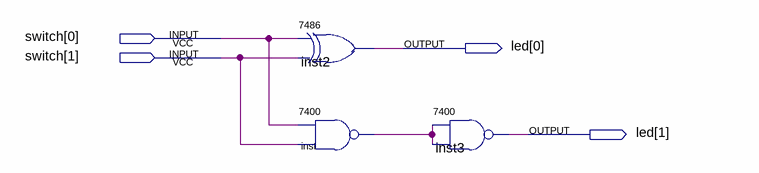
[diagram p0: schematic sheet]
// Quartus schematic pj201.bdf as structural Verilog: 3 symbols, 4 pins
module pj201 (
  input  [1:0] switch,
  output [1:0] led
);

  wire inst_1;

  \7486  inst2 (.\2 (switch[0]), .\3 (switch[1]), .\1 (led[0]));
  \7400  inst (.\3 (switch[1]), .\2 (switch[0]), .\1 (inst_1));
  \7400  inst3 (.\3 (inst_1), .\2 (inst_1), .\1 (led[1]));
endmodule
